# Altium schematic sheet 08.SchDoc
size 386 x 246 mm
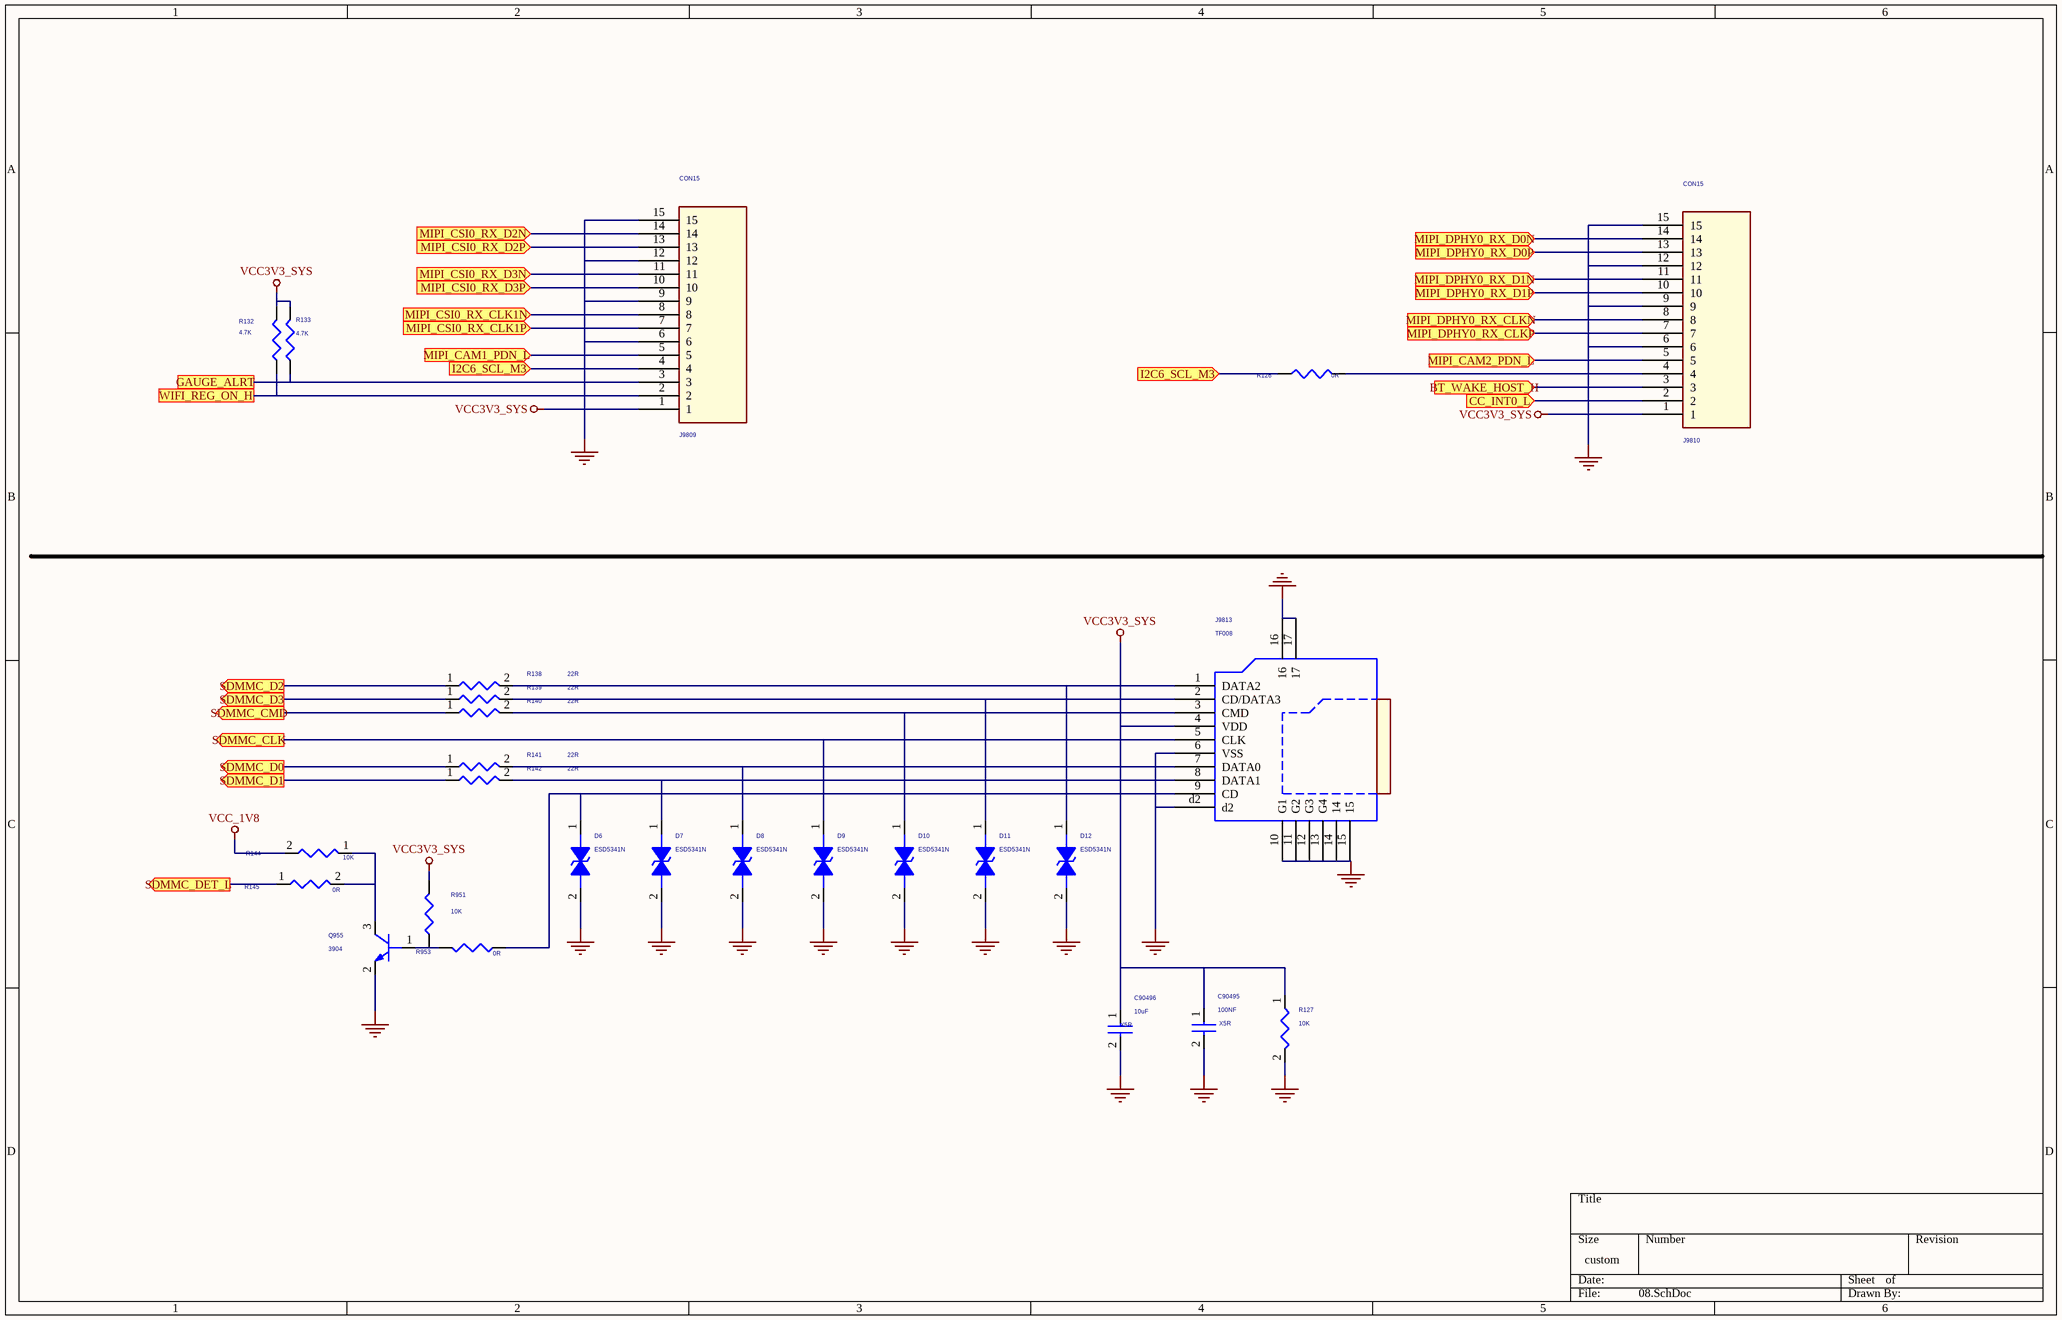
[diagram p0: 08.SchDoc]

## Parts
C90495  100NF  Dielectric: X5R  [R0201]
C90496  10uF  Dielectric: X5R  [C0603]
D6  ESD5341N  [ESD0402]
D7  ESD5341N  [ESD0402]
D8  ESD5341N  [ESD0402]
D9  ESD5341N  [ESD0402]
D10  ESD5341N  [ESD0402]
D11  ESD5341N  [ESD0402]
D12  ESD5341N  [ESD0402]
J9809  CON15  [FPC15PIN-1.0MM-LS]
J9810  CON15  [FPC15PIN-1.0MM-LS]
J9813  TF008  [TF-CKT01-009D]
Q955  3904  [SOT723]
R126  0R  [R0402]
R127  10K  [R0402]
R132  4.7K  [R0402]
R133  4.7K  [R0402]
R138  22R  [R0402]
R139  22R  [R0402]
R140  22R  [R0402]
R141  22R  [R0402]
R142  22R  [R0402]
R144  10K  [R0402]
R145  0R  [R0402]
R951  10K  [R0402]
R953  0R  [R0402]

## Ports
BT_WAKE_HOST_H (in), CC_INT0_L (in), GAUGE_ALRT, I2C6_SCL_M3 (in), MIPI_CAM1_PDN_L (in), MIPI_CAM2_PDN_L (in), MIPI_CSI0_RX_CLK1N (in), MIPI_CSI0_RX_CLK1P (in), MIPI_CSI0_RX_D2N (in), MIPI_CSI0_RX_D2P (in), MIPI_CSI0_RX_D3N (in), MIPI_CSI0_RX_D3P (in), MIPI_DPHY0_RX_CLKN (in), MIPI_DPHY0_RX_CLKP (in), MIPI_DPHY0_RX_D0N (in), MIPI_DPHY0_RX_D0P (in), MIPI_DPHY0_RX_D1N (in), MIPI_DPHY0_RX_D1P (in), SDMMC_CLK (out), SDMMC_CMD (out), SDMMC_D0 (out), SDMMC_D1 (out), SDMMC_D2 (out), SDMMC_D3 (out), SDMMC_DET_L (out), WIFI_REG_ON_H

## Nets
GND: C90495.2 C90496.2 D6.2 D7.2 D8.2 D9.2 D10.2 D11.2 D12.2 J9809.6 J9809.9 J9809.12 J9809.15 J9810.6 J9810.9 J9810.12 J9810.15 J9813.6(VSS) J9813.10(G1) J9813.11(G2) J9813.12(G3) J9813.13(G4) J9813.14 J9813.15 J9813.16 J9813.17 J9813.d2 Q955.2(EMITTER) R127.2
VCC3V3_SYS: C90495.1 C90496.1 J9809.1 J9810.1 J9813.4(VDD) R127.1 R132.2 R133.2 R951.2
VCC_1V8: R144.2
BT_WAKE_HOST_H: J9810.3 ; port BT_WAKE_HOST_H
CC_INT0_L: J9810.2 ; port CC_INT0_L
GAUGE_ALRT: J9809.3 R133.1 ; port GAUGE_ALRT
I2C6_SCL_M3: J9809.4 R126.1 ; port I2C6_SCL_M3
MIPI_CAM1_PDN_L: J9809.5 ; port MIPI_CAM1_PDN_L
MIPI_CAM2_PDN_L: J9810.5 ; port MIPI_CAM2_PDN_L
MIPI_CSI0_RX_CLK1N: J9809.8 ; port MIPI_CSI0_RX_CLK1N
MIPI_CSI0_RX_CLK1P: J9809.7 ; port MIPI_CSI0_RX_CLK1P
MIPI_CSI0_RX_D2N: J9809.14 ; port MIPI_CSI0_RX_D2N
MIPI_CSI0_RX_D2P: J9809.13 ; port MIPI_CSI0_RX_D2P
MIPI_CSI0_RX_D3N: J9809.11 ; port MIPI_CSI0_RX_D3N
MIPI_CSI0_RX_D3P: J9809.10 ; port MIPI_CSI0_RX_D3P
MIPI_DPHY0_RX_CLKN: J9810.8 ; port MIPI_DPHY0_RX_CLKN
MIPI_DPHY0_RX_CLKP: J9810.7 ; port MIPI_DPHY0_RX_CLKP
MIPI_DPHY0_RX_D0N: J9810.14 ; port MIPI_DPHY0_RX_D0N
MIPI_DPHY0_RX_D0P: J9810.13 ; port MIPI_DPHY0_RX_D0P
MIPI_DPHY0_RX_D1N: J9810.11 ; port MIPI_DPHY0_RX_D1N
MIPI_DPHY0_RX_D1P: J9810.10 ; port MIPI_DPHY0_RX_D1P
SDMMC_CLK: D9.1 J9813.5(CLK) ; port SDMMC_CLK
SDMMC_CMD: R140.1 ; port SDMMC_CMD
SDMMC_D0: R141.1 ; port SDMMC_D0
SDMMC_D1: R142.1 ; port SDMMC_D1
SDMMC_D2: R138.1 ; port SDMMC_D2
SDMMC_D3: R139.1 ; port SDMMC_D3
SDMMC_DET_L: R145.1 ; port SDMMC_DET_L
WIFI_REG_ON_H: J9809.2 R132.1 ; port WIFI_REG_ON_H
NetD6_1: D6.1 J9813.9(CD) R953.1
NetD7_1: D7.1 J9813.8(DATA1) R142.2
NetD8_1: D8.1 J9813.7(DATA0) R141.2
NetD10_1: D10.1 J9813.3(CMD) R140.2
NetD11_1: D11.1 J9813.2(CD/DATA3) R139.2
NetD12_1: D12.1 J9813.1(DATA2) R138.2
NetJ9810_4: J9810.4 R126.2
NetQ955_1: Q955.1(BASE) R951.1 R953.2
NetQ955_3: Q955.3(COLLECTOR) R144.1 R145.2

## Library data of the parts
C90495 = CAP NP: cap,100.00nF,+/-10%,10V,X5R,C0402; Manufacturer: TDK; Number: 37; RK PN: C1005X5R1A104K050BA; Priority: A; Tolerance: 10%; C_Voltage: 6.3V; Voltage: 10V; Part Type: C0402; Manufacturer PN: C1005X5R1A104K050BA; Created by: JJJ
C90496 = CAP NP: cap,10.00uF,+/-10%,10V,X5R,C0603; Manufacturer PN: C1608X5R1A106K080AC; Manufacturer: TDK; Tolerance: 10%; C_Voltage: 6.3V; Priority: A; Voltage: 10V; Created by: JJJ; Part Type: C0603; RK PN: C1608X5R1A106K080AC
D6-D12 = DIODE BI_DIR TRIG: 1-Line, Bi-directional, Transient Voltage Suppressors.1pF.; Manufacturer: WillSemi(韦尔半导体); Priority: A; Created by: JJJ; Manufacturer PN: ESD5341N; Part Type: ESD_TVS; RK PN: ESD5341N
J9809 J9810 = CON15_0
J9813 = TFCARD_SOCKET_0: 通用TF卡座，全尺寸; Manufacturer: 旺科达; Priority: A; RK PN: TF_SOCKET; Created by: JJJ; Manufacturer Part Number: TF-CKT01-009D; Part Type: CARD Jack
Q955 = NPN: S8050,SOT23; Manufacturer: 长电; Manufacturer PN: S8050_SOT23; Priority: A; Ic: 0.5A; Vceo: 25V; Pc: 0.3W; RK PN: S8050; Part Type: NPN; Created by: JJJ
R126 = RESISTOR_3: 通用厚膜电阻,4K7,+/-1%,R0402,1/16W.; Manufacturer PN: RC0402FR-074K7L; Manufacturer: YAGEO; Tolerance: 1%; Wattage: 1/16W; Priority: A; Created by: YTL; Part Type: 通用厚膜电阻; RK PN: RC0402FR-074K7L
R127 = RESISTOR: 通用厚膜电阻,10K,+/-5%,R0402,1/16W.; Manufacturer: YAGEO; Tolerance: 5%; option: DNP; RK PN: RC0402JR-0710KL; Priority: A; Wattage: 1/16W; Part Type: 通用厚膜电阻; Manufacturer PN: RC0402JR-0710KL; Created by: YTL
R132 R133 = R_2
R138-R141 R144 R145 = RESISTOR: 通用厚膜电阻,22R,+/-5%,R0402,1/16W.; Manufacturer PN: RC0402JR-0722RL; Manufacturer: YAGEO; Tolerance: 5%; Wattage: 1/16W; Priority: A; Created by: YTL; Part Type: 通用厚膜电阻; RK PN: RC0402JR-0722RL
R142 = RESISTOR: 通用厚膜电阻,22R,+/-5%,R0402,1/16W.; Manufacturer: YAGEO; Tolerance: 5%; RK PN: RC0402JR-0722RL; Priority: A; Wattage: 1/16W; Part Type: 通用厚膜电阻; Manufacturer PN: RC0402JR-0722RL; Created by: YTL
R951 = RESISTOR_Dup2: ROHS CHIP RES 200 Ohm 1/16W +/-5%; BOM_TYPE: 20; BOM_VALUE: 0
R953 = RESISTOR_2: 通用厚膜电阻,10K,+/-5%,R0402,1/16W.; Manufacturer: YAGEO; Tolerance: 5%; RK PN: RC0402JR-0710KL; Priority: A; Wattage: 1/16W; Part Type: 通用厚膜电阻; Manufacturer PN: RC0402JR-0710KL; Created by: YTL